# EAGLE design schematic (EAGLE 9.6.0)
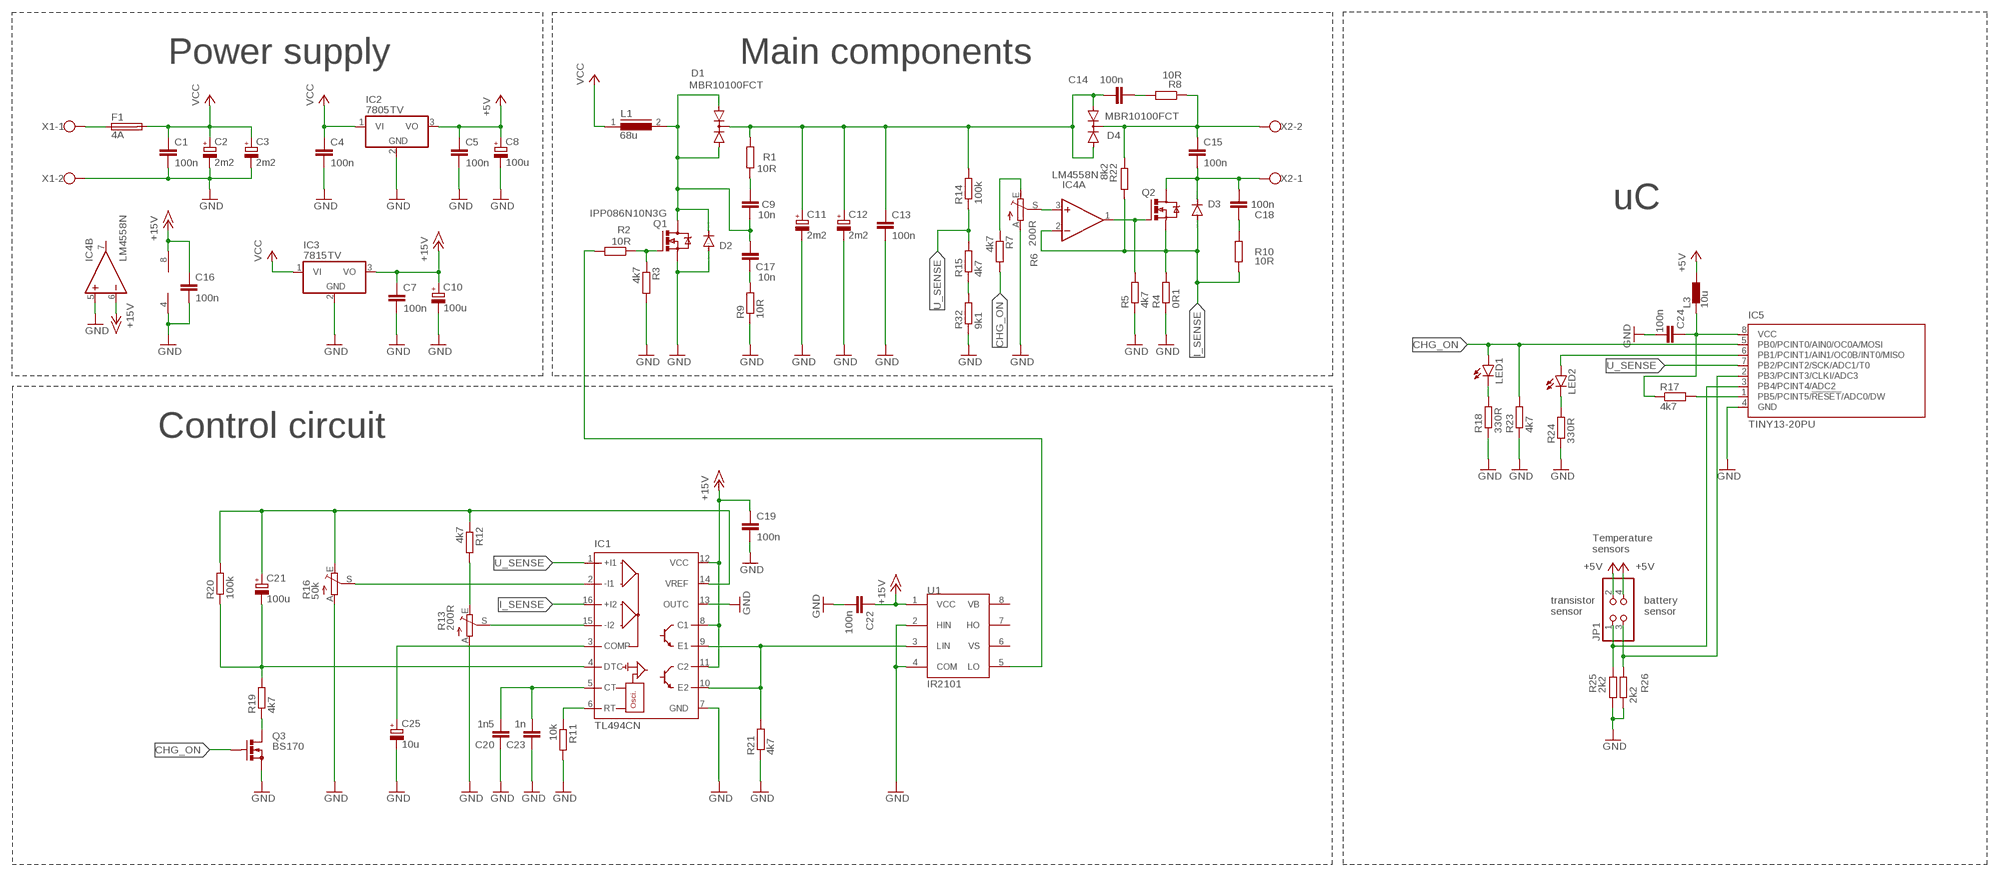
[diagram p0: schematic, sheet 1]

## Parts
C1  100n  C2.5/2  [C2.5-2]
C2  2m2  CPOL-EUE7.5-16  [E7,5-16]
C3  2m2  CPOL-EUE7.5-16  [E7,5-16]
C4  100n  C2.5/2  [C2.5-2]
C5  100n  C2.5/2  [C2.5-2]
C7  100n  C2.5/2  [C2.5-2]
C8  100u  CPOL-EUE3.5-8  [E3,5-8]
C9  10n  C2.5/2  [C2.5-2]
C10  100u  CPOL-EUE3.5-8  [E3,5-8]
C11  2m2  CPOL-EUE7.5-18  [E7,5-18]
C12  2m2  CPOL-EUE7.5-18  [E7,5-18]
C13  100n  C2.5/2  [C2.5-2]
C14  100n  C2.5/2  [C2.5-2]
C15  100n  C2.5/2  [C2.5-2]
C16  100n  C2.5/2  [C2.5-2]
C17  10n  C2.5/2  [C2.5-2]
C18  100n  C2.5/2  [C2.5-2]
C19  100n  C2.5/2  [C2.5-2]
C20  1n5  C2.5/2  [C2.5-2]
C21  100u  CPOL-EUE3.5-8  [E3,5-8]
C22  100n  C2.5/2  [C2.5-2]
C23  1n  C2.5/2  [C2.5-2]
C24  100n  C2.5/2  [C2.5-2]
C25  10u  CPOL-EUE2.5-5  [E2,5-5]
D1  MBR10100FCT  BYV32  [TO220ABS]
D2  1N4933  [DO41-10]
D3  1N4933  [DO41-10]
D4  MBR10100FCT  BYV32  [TO220ABS]
F1  4A  SH22  [SH22]
IC1  TL494CN  [DIL16]
IC2  7805TV  [TO220V]
IC3  7815TV  [TO220V]
IC4  LM4558N  [DIL08]
IC5  TINY13-20PU  [DIL08]
JP1  PINHD-2X2  [2X02]
L1  68u  SFT1240  [SFT1240]
L3  10u  BL01RN1A  [BL01RN1A]
LED1  LED5MM  [LED5MM]
LED2  LED5MM  [LED5MM]
Q1  IPP086N10N3G  IRF520  [TO220BV]
Q2  IRF520  [TO220BV]
Q3  BS170  [SOT54E]
R1  10R  R-EU_0204/7  [0204/7]
R2  10R  R-EU_0204/7  [0204/7]
R3  4k7  R-EU_0204/7  [0204/7]
R4  0R1  R-EU_0204/5  [0204/5]
R5  4k7  R-EU_0204/7  [0204/7]
R6  200R  TRIM_EU-B64Y  [B64Y]
R7  4k7  R-EU_0204/7  [0204/7]
R8  10R  R-EU_0204/7  [0204/7]
R9  10R  R-EU_0204/7  [0204/7]
R10  10R  R-EU_0204/7  [0204/7]
R11  10k  R-EU_0204/7  [0204/7]
R12  4k7  R-EU_0204/7  [0204/7]
R13  200R  TRIM_EU-B64Y  [B64Y]
R14  100k  R-EU_0204/7  [0204/7]
R15  4k7  R-EU_0204/7  [0204/7]
R16  50k  TRIM_EU-B64W  [B64W]
R17  4k7  R-EU_0204/7  [0204/7]
R18  330R  R-EU_0204/7  [0204/7]
R19  4k7  R-EU_0204/7  [0204/7]
R20  100k  R-EU_0204/7  [0204/7]
R21  4k7  R-EU_0204/7  [0204/7]
R22  8k2  R-EU_0204/7  [0204/7]
R23  4k7  R-EU_0204/7  [0204/7]
R24  330R  R-EU_0204/7  [0204/7]
R25  2k2  R-EU_0204/7  [0204/7]
R26  2k2  R-EU_0204/7  [0204/7]
R32  9k1  R-EU_0204/7  [0204/7]
U1  IR2101  [DIL08]
X1  W237-102  [W237-102]
X2  W237-102  [W237-102]

## Nets
+5V: C5.1 C8.+ IC2.3(VO) JP1.2 JP1.4 L3.2
+15V: C7.1 C10.+ C16.1 C19.1 C22.1 IC1.8(C1) IC1.11(C2) IC1.12(VCC) IC3.3(VO) IC4.6(B:-IN) IC4.8(P:V+) U1.1(VCC)
CHG_ON: IC5.5(PB0/PCINT0/AIN0/OC0A/MOSI) LED1.A Q3.G R7.2 R23.2
GND: C1.2 C2.- C3.- C4.2 C5.2 C7.2 C8.- C10.- C11.- C12.- C13.2 C16.2 C19.2 C20.1 C22.2 C23.1 C24.2 C25.- D2.A IC1.7(GND) IC1.13(OUTC) IC2.2(GND) IC3.2(GND) IC4.4(P:V-) IC4.5(B:+IN) IC5.4(GND) Q1.S Q3.S R3.2 R4.1 R5.1 R6.A R9.1 R11.2 R13.A R16.A R18.1 R21.1 R23.1 R24.1 R25.1 R26.1 R32.1 U1.2(HIN) U1.4(COM) X1.2
I_SENSE: D3.A IC1.16(+I2) IC4.2(A:-IN) Q2.S R4.2 R10.2 R22.2
N$1: F1.1 X1.1
N$2: C18.2 R10.1
N$3: C11.+ C12.+ C13.1 C14.2 D1.C D4.A1 D4.A2 R1.2 R14.2
N$4: Q1.G R2.1 R3.1
N$5: C17.2 R9.2
N$6: IC1.15(-I2) R13.S
N$7: C15.2 C18.1 D3.C Q2.D X2.1
N$8: IC4.1(A:OUT) Q2.G R5.2
N$9: R6.E R7.1
N$10: IC4.3(A:+IN) R6.S
N$11: C14.1 R8.2
N$12: C15.1 D4.C R8.1 R22.1 X2.2
N$13: C9.2 C17.1 D1.A1 D1.A2 D2.C L1.2 Q1.D
N$14: C9.1 R1.1
N$15: C20.2 C23.2 IC1.5(CT)
N$16: IC1.6(RT) R11.1
N$17: R12.2 R13.E
N$18: C21.+ IC1.14(VREF) R12.1 R16.E R20.2
N$19: IC1.2(-I1) R16.S
N$20: LED2.K(C) R24.2
N$21: IC5.1(PB5/PCINT5/!RESET!/ADC0/DW) R17.2
N$22: Q3.D R19.1
N$23: C21.- IC1.4(DTC) R19.2 R20.1
N$24: IC1.9(E1) IC1.10(E2) R21.2 U1.3(LIN)
N$25: R2.2 U1.5(LO)
N$26: LED1.K(C) R18.2
N$27: C25.+ IC1.3(COMP)
N$28: C24.1 IC5.8(VCC) L3.1 R17.1
N$29: IC5.6(PB1/PCINT1/AIN1/OC0B/INT0/MISO) LED2.A
N$30: IC5.3(PB4/PCINT4/ADC2) JP1.1 R25.2
N$31: IC5.2(PB3/PCINT3/CLKI/ADC3) JP1.3 R26.2
N$37: R15.1 R32.2
U_SENSE: IC1.1(+I1) IC5.7(PB2/PCINT2/SCK/ADC1/T0) R14.1 R15.2
VCC: C1.1 C2.+ C3.+ C4.1 F1.2 IC2.1(VI) IC3.1(VI) L1.1
Unconnected: IC4.7(B:OUT) U1.6(VS) U1.7(HO) U1.8(VB)

## Notes on the sheet
- Power supply | Main components
- uC
- Control circuit
- Temperature 
  sensors
- transistor 
  sensor
- battery
  sensor

## Library data of the parts
C1 C4 C5 C7 C9 C13-C20 C22-C24 = capacitor-wima:C: CAPACITOR naming: grid - package width
C2 C3 C8 C10-C12 C21 C25 = rcl:CPOL-EU: POLARIZED CAPACITOR, European symbol; SPICEPREFIX: C
D1 D4 = diode:BYV32: DIODE 2 x Si diode 200 V, 20 A/230 Apeak, 25 ns
D2 D3 = diode:1N4933: DIODE fast recovery rectifier, 1A
F1 = fuse:SH22: FUSE HOLDER CS PFP30, Schukat; OC_FARNELL: unknown; OC_NEWARK: unknown
IC1 = linear:TL494*: SWITCHMODE Pulse Width Modulation Control Circuit NCV494B http://onsemi.com tl494-d.pdf
IC2 IC3 = linear:78*: Positive VOLTAGE REGULATOR Source: http://cache.national.com/ds/LM/LM78L05.pdf http://www.fairchildsemi.com/ds/LM/LM7805.pdf
IC4 = linear:*4558: OP AMP
IC5 = atmel:TINY13: 8-bit AVR Microcontroller with 1K Bytes In-System Programmable Flash Source: http://www.atmel.com/dyn/resources/prod_documents/2535S.pdf; MPN: ATTINY13-20PU; OC_FARNELL: 9171550; OC_NEWARK: 96K6521
JP1 = pinhead:PINHD-2X2: PIN HEADER
L1 = inductors:SFT1240: INDUCTOR; SPICEPREFIX: L
L3 = inductors:BL0: Noise Suppression Products/EMI Suppression Filters, Lead EMIFIL(R) Inductor Type Source: http://www.murata.com .. BL01RN1_DS.pdf
LED1 LED2 = led:LED: LED OSRAM: - CHIPLED LG R971, LG N971, LY N971, LG Q971, LY Q971, LO R971, LY R971 LH N974, LH R974 LS Q976, LO Q976, LY Q976 LO Q996 - Hyper CHIPLED LW Q18S LB Q993, LB Q99A, LB R99A - SideLED LS A670, LO A670, LY A670, LG A670, LP A670 LB A673, LV A673, LT A673, LW A673 LH A674 LY A675 LS A676, LA A676, LO A676, LY A676, LW A676 LS A679, LY A679, LG A679 - Hyper Micro SIDELED® LS Y876, LA Y876, LO Y876, LY Y876 LT Y87S - SmartLED LW L88C, LW L88S LB L89C, LB L89S, LG L890 LS L89K, LO L89K, LY L89K LS L896, LA L896, LO L896, LY L896 - TOPLED LS T670, LO T670, LY T670, LG T670, LP T670 LSG T670, LSP T670, LSY T670, LOP T670, LYG T670 LG T671, LOG T671, LSG T671 LB T673, LV T673, LT T673, LW T673 LH T674 LS T676, LA T676, LO T676, LY T676, LB T676, LH T676, LSB T676, LW T676 LB T67C, LV T67C, LT T67C, LS T67K, LO T67K, LY T67K, LW E67C LS E67B, LA E67B, LO E67B, LY E67B, LB E67C, LV E67C, LT E67C LW T67C LS T679, LY T679, LG T679 LS T770, LO T770, LY T770, LG T770, LP T770 LB T773, LV T773, LT T773, LW T773 LH T774 LS E675, LA E675, LY E675, LS T675 LS T776, LA T776, LO T776, LY T776, LB T776 LHGB T686 LT T68C, LB T68C - Hyper Mini TOPLED® LB M676 - Mini TOPLED Santana® LG M470 LS M47K, LO M47K, LY M47K Source: http://www.osram.convergy.de LUXEON: - LUMILED® LXK2-PW12-R00, LXK2-PW12-S00, LXK2-PW14-U00, LXK2-PW14-V00 LXK2-PM12-R00, LXK2-PM12-S00, LXK2-PM14-U00 LXK2-PE12-Q00, LXK2-PE12-R00, LXK2-PE12-S00, LXK2-PE14-T00, LXK2-PE14-U00 LXK2-PB12-K00, LXK2-PB12-L00, LXK2-PB12-M00, LXK2-PB14-N00, LXK2-PB14-P00, LXK2-PB14-Q00 LXK2-PR12-L00, LXK2-PR12-M00, LXK2-PR14-Q00, LXK2-PR14-R00 LXK2-PD12-Q00, LXK2-PD12-R00, LXK2-PD12-S00 LXK2-PH12-R00, LXK2-PH12-S00 LXK2-PL12-P00, LXK2-PL12-Q00, LXK2-PL12-R00 Source: www.luxeon.com KINGBRIGHT: KA-3528ASYC Source: www.kingbright.com
Q1 Q2 = transistor-power:IRF520: HEXFET Power MOSFET
Q3 = transistor-small-signal:BS170: N-CHANNEL MOS FET
R1-R5 R7-R12 R14 R15 R17-R26 R32 = rcl:R-EU_: RESISTOR, European symbol; SPICEPREFIX: R
R6 R13 R16 = pot:TRIM_EU-: POTENTIOMETER
U1 = irf-2:IR2101: High and low side driver
X1 X2 = con-wago-500:W237-102: WAGO SCREW CLAMP; MPN: 237-102; OC_FARNELL: unknown; OC_NEWARK: 70K9898

## Board
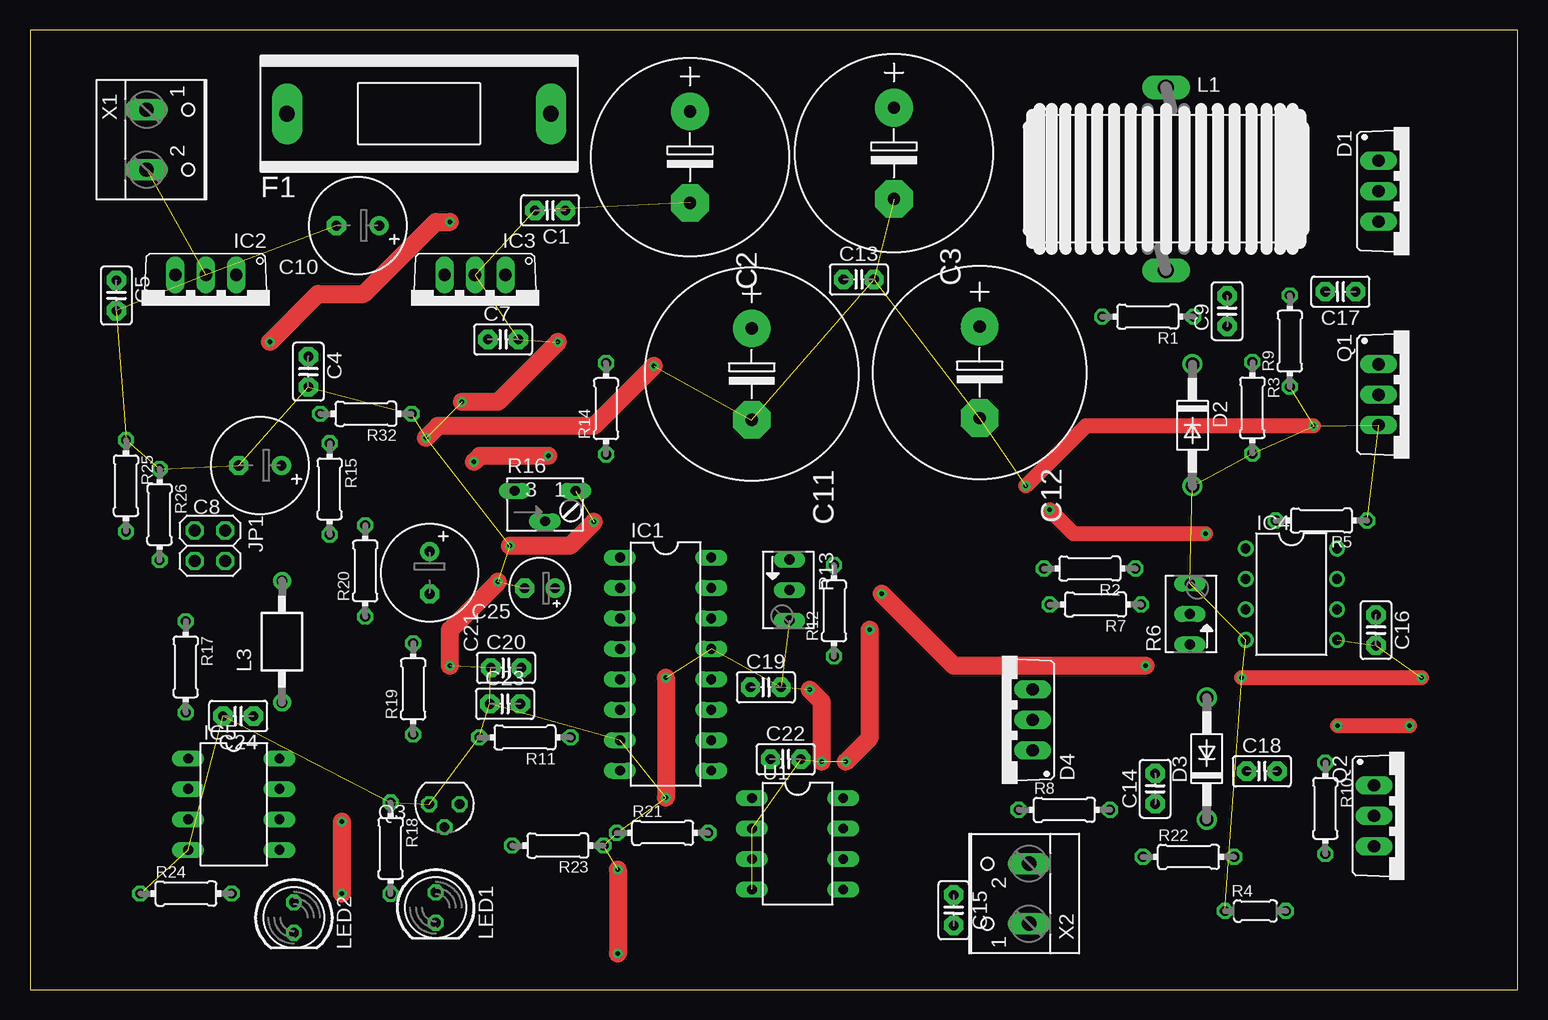
[diagram p1: board, top side]
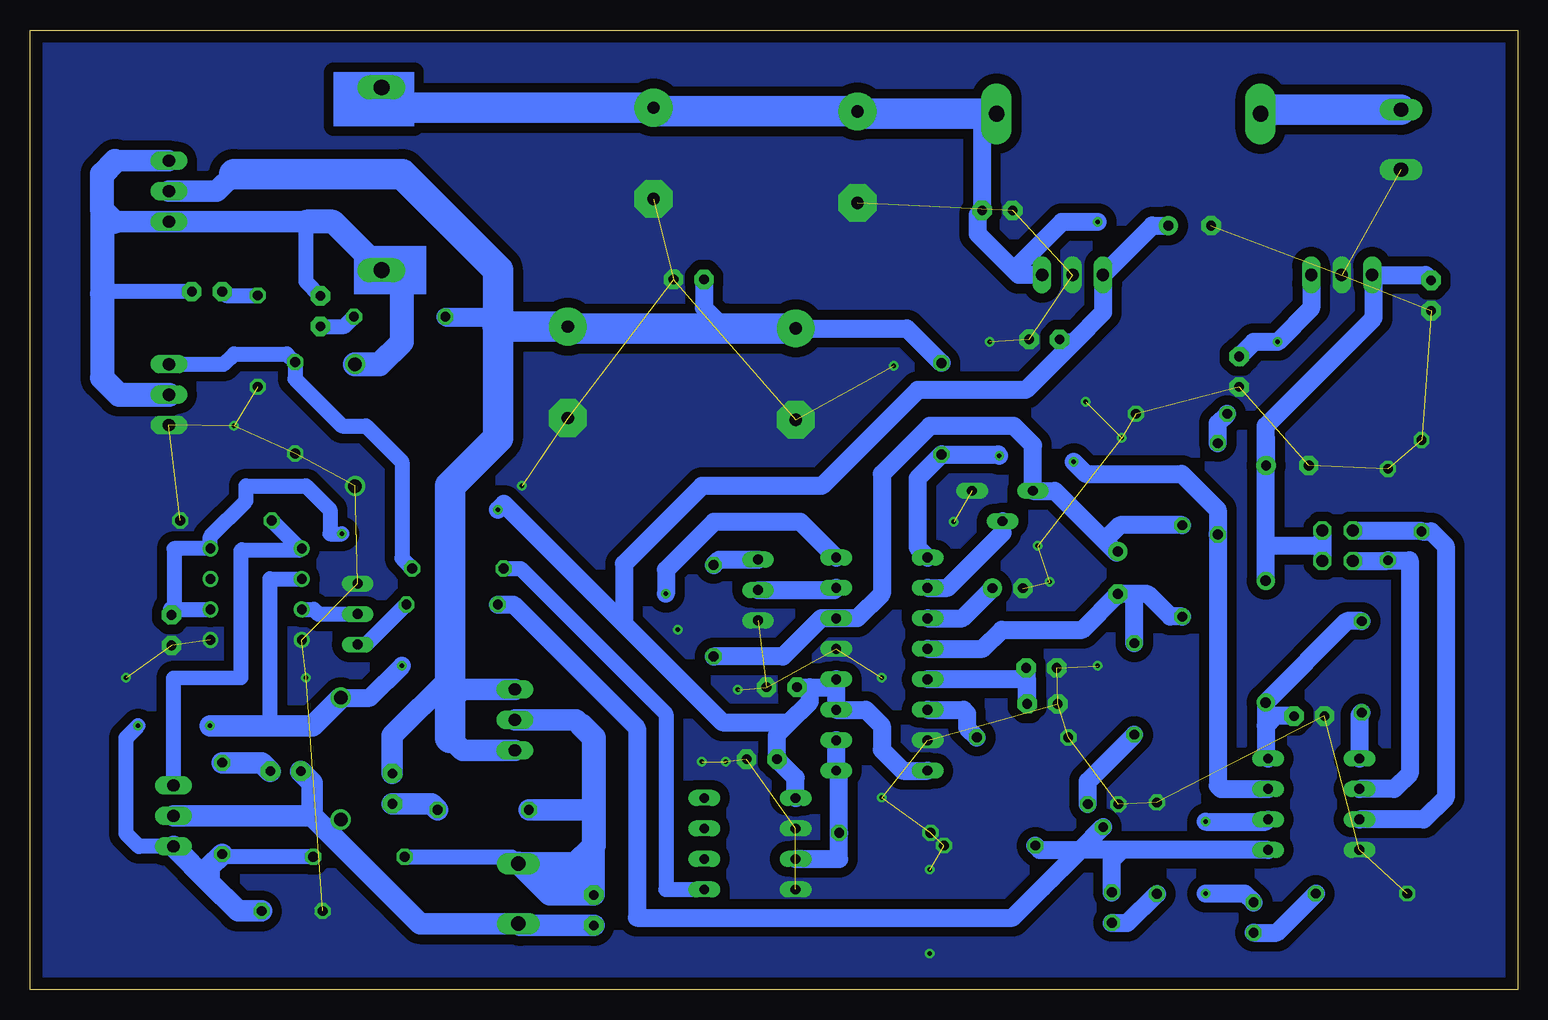
[diagram p2: board, bottom side, seen from below]

Size 124 x 80 mm. Coordinates in mm from the lower left corner, seen from the top.
Outline: 0,0 124,0 124,80 0,80 0,0
Copper layers (1*16): Top 0.035mm / dielectric 1.5mm / Bottom 0.035mm
Design rules "default": minimum track width 6mil, minimum drill 0.35mm, track to track 6mil, track to pad 6mil, pad to pad 6mil, via to via 6mil, smd to smd 6mil, copper to edge 40mil, drill to drill 6mil, minimum pad ring 10mil, minimum via ring 8mil, stop-mask expansion 4mil, vias tented up to drill 0mil, thermal gap 10mil

### Footprints (pad centres in the part's own frame; a part is rotated, then mirrored left to right if it is on the bottom)
C2.5-2 = drill 0.813 pad 1.6 octagon: 1 -1.27,0; 2 1.27,0
E7,5-16 = drill 1.016 pad 3.15: + -3.81,0 | drill 1.016 pad 3.15 octagon: - 3.81,0
E3,5-8 = drill 0.813 pad 1.6: + -1.778,0 | drill 0.813 pad 1.6 octagon: - 1.778,0
E7,5-18 = drill 1.016 pad 3.15: + -3.81,0 | drill 1.016 pad 3.15 octagon: - 3.81,0
E2,5-5 = drill 0.813 pad 1.6: + -1.27,0 | drill 0.813 pad 1.6 octagon: - 1.27,0
TO220ABS = drill 1.016 long: A1 -2.54,-2.54; A2 2.54,-2.54; C 0,-2.54
DO41-10 = drill 1.118: A 5.08,0; C -5.08,0
SH22 = drill 1.321 pad 2.54 long: 1 -10.998,0; 2 10.998,0
DIL16 = drill 0.813 long: 1 -8.89,-3.81; 2 -6.35,-3.81; 3 -3.81,-3.81; 4 -1.27,-3.81; 5 1.27,-3.81; 6 3.81,-3.81; 7 6.35,-3.81; 8 8.89,-3.81; 9 8.89,3.81; 10 6.35,3.81; 11 3.81,3.81; 12 1.27,3.81; 13 -1.27,3.81; 14 -3.81,3.81; 15 -6.35,3.81; 16 -8.89,3.81
TO220V = drill 1.016 long: 1 -2.54,-2.54; 2 0,-2.54; 3 2.54,-2.54
DIL08 = drill 0.813 pad 1.27: 1 -3.81,-3.81; 2 -1.27,-3.81; 3 1.27,-3.81; 4 3.81,-3.81; 5 3.81,3.81; 6 1.27,3.81; 7 -1.27,3.81; 8 -3.81,3.81
DIL08' = drill 0.813 long: 1 -3.81,-3.81; 2 -1.27,-3.81; 3 1.27,-3.81; 4 3.81,-3.81; 5 3.81,3.81; 6 1.27,3.81; 7 -1.27,3.81; 8 -3.81,3.81
2X02 = drill 1.016 octagon: 1 -1.27,-1.27; 2 -1.27,1.27; 3 1.27,-1.27; 4 1.27,1.27
SFT1240 = drill 1.321 long: 1 -7.62,0; 2 7.62,0
BL01RN1A = drill 0.9 pad 1.5: 1 -5.08,0; 2 5.08,0
LED5MM = drill 0.813 octagon: A -1.27,0; K 1.27,0
TO220BV = drill 1.016 long: D 0,-2.54; G -2.54,-2.54; S 2.54,-2.54
SOT54E = drill 0.813 octagon: D -1.27,0; G 0,1.905; S 1.27,0
0204/7 = drill 0.813 octagon: 1 -3.81,0; 2 3.81,0
0204/5 = drill 0.813 octagon: 1 -2.54,0; 2 2.54,0
B64Y = drill 0.813 long: A 2.54,0; E -2.54,0; S 0,0
B64W = drill 0.813 long: A 2.54,0; E -2.54,0; S 0,-2.54
W237-102 = drill 1.194 long: 1 -2.5,-1.27; 2 2.5,-1.27

### Placement (x,y rotation side)
C1  43.36,64.96 180 top
C2  55.02,69.4 270 top
C3  72.02,69.72 270 top
C4  23.2,51.51 270 top
C5  7.2,57.86 270 top
C7  39.44,54.2 0 top
C8  19.18,43.69 180 top
C9  99.8,56.56 90 top
C10  27.32,63.69 180 top
C11  60.16,51.31 270 top
C12  79.16,51.45 270 top
C13  69.09,59.2 0 top
C14  93.8,16.74 90 top
C15  77,6.61 270 top
C16  112.2,29.96 270 top
C17  109.24,58.18 180 top
C18  102.69,18.2 0 top
C19  61.34,25.2 0 top
C20  39.68,26.82 0 top
C21  33.31,34.75 270 top
C22  62.99,19.2 0 top
C23  39.6,23.82 0 top
C24  17.36,22.8 180 top
C25  42.5,33.45 180 top
D1  114.96,66.56 270 top
D2  96.9,47.05 270 top
D3  98.1,19.25 90 top
D4  81.04,22.47 90 top
F1  32.42,73.02 0 top
IC1  52.99,27.13 270 top
IC2  14.66,57.04 180 top
IC3  37.09,57.04 180 top
IC4  105.15,32.96 270 top
IC5  TINY13-20PU  [DIL08']  16.99,15.45 270 top
JP1  15,37 270 top
L1  94.7,67.59 270 top
L3  21,29 90 top
LED1  33.82,6.83 270 top
LED2  22,6 270 top
Q1  114.96,49.59 270 top
Q2  114.58,14.47 270 top
Q3  34.55,15.45 180 top
R1  93.18,56.1 180 top
R2  88.34,35.1 180 top
R3  101.9,48.5 270 top
R4  102.15,6.55 0 top
R5  107.66,39.1 180 top
R6  96.69,31.31 90 top
R7  88.82,32.1 180 top
R8  86.22,14.98 0 top
R9  105.02,54.06 90 top
R10  107.98,15.1 270 top
R11  41.26,21.02 180 top
R12  67.02,31.58 90 top
R13  63.31,33.31 270 top
R14  48.02,48.42 90 top
R15  24.98,41.74 270 top
R16  42.93,41.58 0 top
R17  12.98,26.9 270 top
R18  30.06,11.78 270 top
R19  31.94,25.06 90 top
R20  27.94,34.9 90 top
R21  52.74,13.06 0 top
R22  96.58,11.06 0 top
R23  44,12 180 top
R24  13,8 0 top
R25  8,42 270 top
R26  10.8,39.6 270 top
R32  28,48 180 top
U1  IR2101  [DIL08']  63.99,12.15 270 top
X1  10.99,70.85 270 top
X2  82.01,7.99 90 top

### Tracks (layer width: path | path; a pad name or v marks a point on that pad's centre or on a via)
+5V
  Bottom 1.5: C5.1 7.65,59.58 IC2.3 12,59.46 12,56 21,47 21,46 | L3.2 21,37 | 21,37 21,46 | C8.+ 20.96,45.96 21,46 | JP1.2 16.27,37 | 16.27,37 JP1.4 | 16.27,37 21,37
+15V  (via drill 0.35)
  Top 1.27: v98,38 87,38 v85,40
  Bottom 1.27: IC4.6 112.31,31.69 112.2,31.8 | C16.1 112.2,31.8 | 112.2,31.8 112,32 112,36.77 IC4.8 108.96,37.77 106,40.73 106,42 101,42 99,40 99,38 v98,38
  Bottom 1.5: IC1.8 51.24,18.24 53,20 53,22 54.32,23.32 IC1.11 IC1.12 57.46,25.2 59,25.2 | C19.1 59,25.2 | U1.1 60.18,17.66 C22.1 61.72,21.28 60.72,22.28 | 60.72,22.28 59,24 59,25.2 | v85,40 84.5,40.5 74.5,30.5 | 60.72,22.28 66.28,22.28 74.5,30.5 | C10.+ 30.44,63.69 IC3.3 34.55,56.45 37,54 | 37,54 41,50 50,50 58,42 68,42 74.5,35.5 74.5,30.5 | C7.1 37.97,54 37,54
CHG_ON
  Bottom 1.5: R7.2 83.7,32.1 73.4,21.8 73.4,6 42.09,6 36.45,11.64 | 36.45,11.64 Q3.G | IC5.5 33,11.64 | 33,11.64 36.45,11.64 | R23.2 39.83,11.64 36.45,11.64 | LED1.A 33.82,10.82 33,11.64
GND  (via drill 0.35)  (55 unrouted)
  Top 1.27: v107,47 88,47 v83,42 | v116,26 v101,26
  Top 1.5: v33,46 34,47 47,47 v52,52 | v44,54 39,49 v36,49 | v49,10 v49,3 | v35,27 35,30 v39,34 | v47,39 45,37 v40,37 | v53,26 v53,16 | v68,19 70,21 v70,30 | v66,19 66,24 v65,25
  pour Bottom (isolate 0.813, no thermals): -1,81 125,81 125,-1 -1,-1
I_SENSE  (via drill 0.35)
  Top 1.27: v115,22 v109,22
  Top 1.5: v93,27 77,27 v71,33
  Bottom 1.27: R22.2 107.75,11.06 R10.2 | Q2.S 114.93,11.93 116,13 116,21 v115,22 | 104,22 104,34.23 IC4.2
  Bottom 1.5: D3.A 95.67,24.33 v93,27 | IC1.16 59.78,39 67,39 71,35 v71,33 | 103,22 100.43,22
  Bottom 1.8: Q2.S 109.06,8.95 | 109.06,8.95 106.66,6.55 R4.2 | R10.2 109.06,10.21 109.06,8.95 | D3.A 100.43,22 104,22 | 103,22 v109,22
N$1
  Bottom 2.54: X1.1 20.65,73.35 21,73 21.4,73 F1.1
N$2
  Bottom 1.8: R10.1 104.67,18.91 C18.2
N$3
  Bottom 1.27: 85.1,56.1 85,56
  Bottom 1.5: C13.1 67.82,56.82 66.12,55.12 66,55.12 | C11.+ 50.91,55.12 R14.2 | 85.06,56.1 R1.2 89.27,56 85,56
  Bottom 1.8: D1.C 108.44,66.56 107,68 | D4.A2 87.99,25.01 89,24 89,21 87.93,19.93 D4.A1 | C14.2 93.8,21.2 89,26
  Bottom 2: C12.+ 79.02,55.12
  Bottom 2.54: 85.06,56.1 85.01,55.26 C12.+ | 107,68 93,68 85,60 85,56 85,46 89,42 89,26 89,21 | 79.02,55.12 66,55.12 C11.+
N$4
  Bottom 1.27: Q1.G 107.87,52.13 107,53 102.59,53 R3.1 101.9,50.9 98,47 96,47 93,44 93,35.95 R2.1
N$5
  Bottom 1.27: C17.2 107.66,57.87 R9.2
N$6
  Bottom 1.5: R13.S 56.97,33.31 IC1.15
N$7
  Bottom 1.27: D3.C 98.77,13.5 99.5,13.5
  Bottom 1.8: Q2.D 100.47,14.47 | 100.47,14.47 99.5,13.5 91.49,5.49 X2.1 83.13,5.34 C15.2 | C18.1 100.47,17.25 100.47,14.47
N$8
  Bottom 1.27: Q2.G 112.04,25.97 106.4,26.01 106.4,36.6 106.34,36.66 101.45,36.66 | 101.45,36.66 IC4.1 | R5.2 101.45,36.7 101.45,36.66
N$9
  Bottom 1.27: R6.E 95.96,28.77 R7.1
N$10
  Bottom 1.27: IC4.3 100.34,31.69 99.96,31.31 R6.S
N$11
  Bottom 1.8: R8.2 90.52,15.47 C14.1
N$12
  Bottom 1.27: R22.1 83.85,11.06 X2.2
  Bottom 1.8: 78,22 78.47,22.47 D4.C | R8.1 77.02,14.98 77,15 | 77,13 C15.1 80.67,7.88 X2.2 81.79,9 77,9 77,11
  Bottom 2: X2.2 78.51,10.49 77,12 77,13 77,15 77,21 78,22
N$13
  Bottom 1.27: C9.2 101,59.03 101,64.02 | C17.1 117.82,58.18 118,58
  Bottom 1.8: 101,64.02 D1.A2 117.02,64.02 | 116.9,69.1 D1.A1
  Bottom 2: 101,64.02 98.75,64.02 L1.2 93.97,59.97 93,59 93,54 94.87,52.13 D2.C | 117.02,64.02 118,65 | 118,65 118,68 116.9,69.1 | 118,65 118,58 118,51 116.59,49.59 Q1.D
N$14
  Bottom 1.27: C9.1 97.8,55.29 R1.1
N$15
  Bottom 1.5: C20.2 40.95,23.9 C23.2 40.87,25.82 40.91,25.86 IC1.5
N$16
  Bottom 1.5: IC1.6 46.18,23.32 45.88,23.02 45.88,21.83 R11.1
N$17
  Bottom 1.5: R12.2 66.56,35.85 R13.E
N$18
  Bottom 1.5: R20.2 33.13,38.71 34.42,37.42 | C21.+ 33.42,36.42 34.42,37.42 | 34.42,37.42 38.58,41.58 R16.E 40.39,45.39 42,47 49,47 53,43 53,33 55.06,30.94 IC1.14 58.06,30.94 61.23,27.77 R12.1
N$19
  Bottom 1.5: IC1.2 47.52,33.48 42.93,38.07 R16.S
N$20
  Bottom 1.5: LED2.K 20.08,4.73 R24.2
N$21
  Bottom 1.5: R17.2 13.18,22.89 IC5.1
N$22
  Bottom 1.5: Q3.D 35.82,17.37 R19.1
N$23
  Bottom 1.5: IC1.4 44.6,28.4 43,30 36.28,30 C21.- 31.82,32.97 | R20.1 28.94,31.09 30.82,32.97 31.82,32.97 | R19.2 31.94,32.85 31.82,32.97
N$24
  Bottom 1.5: IC1.10 IC1.9 56.55,17.99 R21.2 56.55,10.88 U1.3
N$25
  Bottom 1.27: R2.2 83.1,35.1 71,23 71,8.34 U1.5
N$26
  Bottom 1.5: LED1.K 32.53,5.56 R18.2
N$27
  Bottom 1.5: IC1.3 46.28,30.94 C25.+
N$28
  Bottom 1.5: 21,22 L3.1 14.21,30.71 R17.1 | 21,22 21,19.46 IC5.8 | C24.1 20.2,22.8 21,22
N$29  (via drill 0.35)
  Top 1.5: v26,8 v26,14
  Bottom 1.5: LED2.A 22.73,8 v26,8 | v26,14 20.98,14 IC5.6
N$30
  Bottom 1.5: JP1.1 8.08,38.27 R25.2 7.19,38.19 6,37 6,16 7.82,14.18 IC5.3
N$31
  Bottom 1.5: JP1.3 10.86,35.73 R26.2 9,35.79 9,18 10.28,16.72 IC5.2
N$37
  Bottom 1.5: R15.1 24.98,47.21 R32.2
U_SENSE  (via drill 0.35)
  Top 1.5: v43.2,44.5 37.5,44.5 v37,44
  Bottom 1.5: IC1.1 50.02,36.86 50.02,42.61 R14.1 43.31,44.61 v43.2,44.5 | v37,44 36,43 28,43 25,40 25,38 | 25,38 25,17 24.72,16.72 IC5.7 | R15.2 24.98,37.98 25,38
VCC  (via drill 0.35)
  Top 1.5: v20,54 23.99,57.99 27.8,57.99 33.82,64 v35,64
  Bottom 1.5: IC3.1 41.58,59.58 42,60 | 42,60 45,63 45,64.59 C1.1 44.63,71.81 F1.2 | IC2.1 17.2,56.8 v20,54 21.98,54 C4.1 | v35,64 38,64 42,60
  Bottom 2.54: F1.2 54.83,73.02 C2.+ 71.7,73.21 C3.+ 94.7,73.53 L1.1
(copper drawn outside any net)
  shapes: Bottom area x2

### Text on the board
tValues: transistor | battery | Error diode | CHG diode